# Altium schematic sheet buck4.schdoc
size A4; SheetNumber: 1; SheetTotal: 1
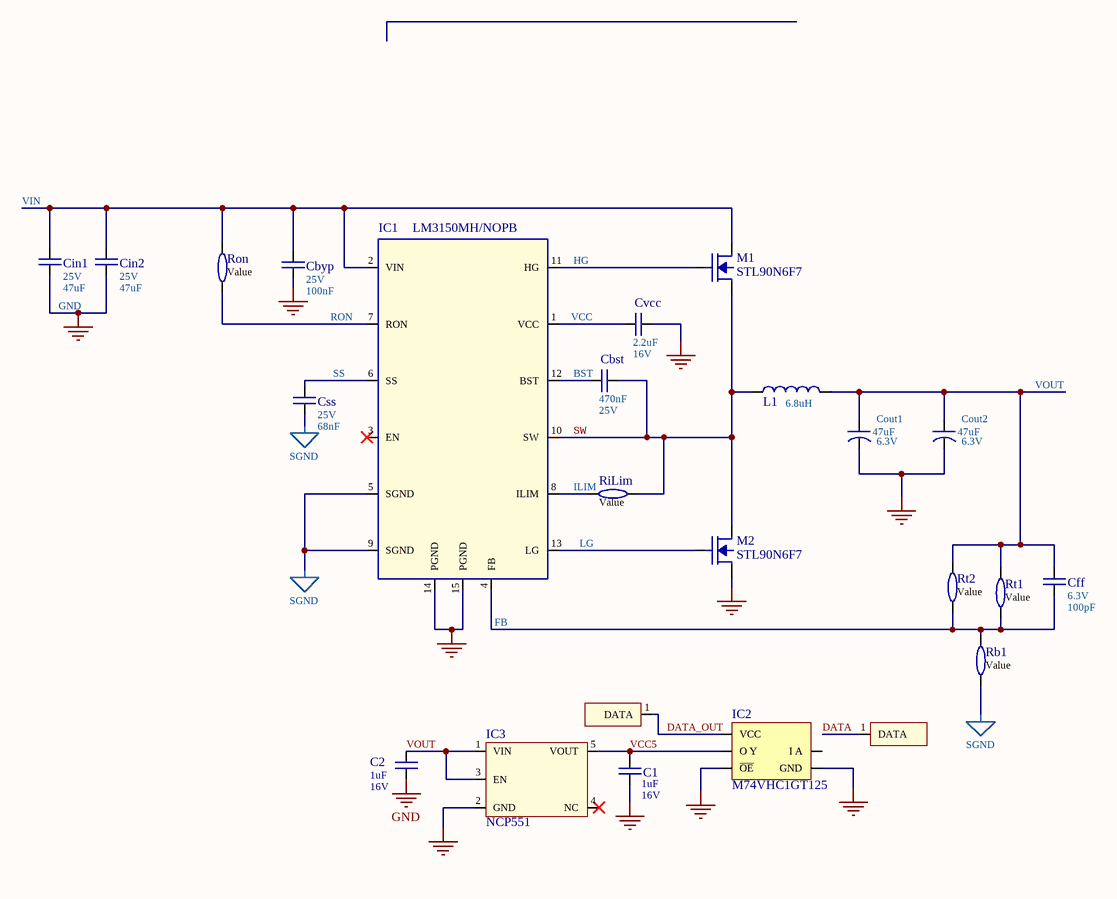
[diagram p0: buck4.schdoc]

## Parts
C1  value 1uF  Voltage: 16V  [CAPC1608X08L]  (hidden comment: MLCC)
C2  value 1uF  Voltage: 16V  [CAPC1608X08L]  (hidden comment: MLCC)
Cbst  value 470nF  Voltage: 25V  [CAPC1608X08L]  (hidden comment: MLCC)
Cbyp  value 100nF  Voltage: 25V  [CAPC2012X12L]  (hidden comment: MLCC)
Cff  value 100pF  Voltage: 6.3V  [CAPC1608X08L]  (hidden comment: MLCC)
Cin1  value 47uF  Voltage: 25V  [CAPC3225X25L]  (hidden comment: MLCC)
Cin2  value 47uF  Voltage: 25V  [CAPC3225X25L]  (hidden comment: MLCC)
Cout1  value 47uF  Voltage: 6.3V  [CAPMP7343X11L]  (hidden comment: CAPACITOR)
Cout2  value 47uF  Voltage: 6.3V  [CAPMP7343X11L]  (hidden comment: CAPACITOR)
Css  value 68nF  Voltage: 25V  [CAPC1608X08L]  (hidden comment: MLCC)
Cvcc  value 2.2uF  Voltage: 16V  [CAPC1608X08L]  (hidden comment: MLCC)
DP1  DATA_PAD  [DATA_PAD]  (value not drawn)  (no BOM)
DP2  DATA_PAD  [DATA_PAD]  (value not drawn)  (no BOM)
IC1  LM3150MH/NOPB  [MXA14A]
IC2  M74VHC1GT125  [SC70-5]
IC3  NCP551  [SOT95P260X90-5L]
L1  value 6.8uH  [WE-HCI_1335]  (hidden comment: 744313330)
M1  STL90N6F7  [TRANS_NexFET_Q5A]
M2  STL90N6F7  [TRANS_NexFET_Q5A]
Rb1  RES0603  [RESC1608X03L]  (value not drawn)
RiLim  RES0603  [RESC1608X03L]  (value not drawn)
Ron  RES0603  [RESC1608X03L]  (value not drawn)
Rt1  RES0603  [RESC1608X03L]  (value not drawn)
Rt2  RES0603  [RESC1608X03L]  (value not drawn)

## Nets
GND: C1.1 C2.1 Cbyp.1 Cin1.1 Cin2.1 Cout1.2(-) Cout2.2(-) Cvcc.2 IC1.14(PGND) IC1.15(PGND) IC2.1(~{OE}) IC2.3(GND) IC3.2(GND) M2.S(Source)
SGND: Css.1 IC1.5(SGND) IC1.9(SGND) Rb1.1
BST: Cbst.1 IC1.12(BST)
DATA: DP2.1(DATA)
DATA_OUT: DP1.1(DATA) IC2.5(VCC)
FB: Cff.1 IC1.4(FB) Rb1.2 Rt1.1 Rt2.1
HG: IC1.11(HG) M1.G(Gate)
ILIM: IC1.8(ILIM) RiLim.1
LG: IC1.13(LG) M2.G(Gate)
RON: IC1.7(RON) Ron.2
SS: Css.2 IC1.6(SS)
SW: Cbst.2 IC1.10(SW) L1.2 M1.S(Source) M2.D(Drain) RiLim.2
VCC: Cvcc.1 IC1.1(VCC)
VCC5: C1.2 IC2.4(O_Y) IC3.5(VOUT)
VIN: Cbyp.2 Cin1.2 Cin2.2 IC1.2(VIN) M1.D(Drain) Ron.1
VOUT: C2.2 Cff.2 Cout1.1(+) Cout2.1(+) IC3.1(VIN) IC3.3(EN) L1.1 Rt1.2 Rt2.2

Not connected (* = marked no-connect by the designer): IC1 3(EN)*; IC2 2(I_A); IC3 4(NC)*

## Library data of the parts
C1 C2 Cbst Cbyp Cff Css Cvcc = MLCC: Multilayer Ceramic Capacitor
  C1 C2: Vendor: *
Cin1 Cin2 = MLCC: Multilayer Ceramic Capacitor; MPN: C3216X5R1E476M160AC; Vendor: TDK
Cout1 Cout2 = CAPACITOR: Electrolytic Capacitor; MPN: EEFCS1A470R; Vendor: Pansonic; TYPE: Polymer
IC1 = LM3150MH/NOPB: Buck controller; Vendor: Texas Instruments; Manufacturer_Part_Number: LM3150MH/NOPB; RefDes: RefDes; TYPE: TYPE; MPN: LM3150MH/NOPB
IC2 = M74VHC1GT125: Level shifter non inverting
L1 = 744313330: Inductor; Vendor: Wurth Elektronik; Manufacturer_Part_Number: 744313330; RefDes: RefDes; TYPE: TYPE; MPN: 744313330
M1 = CSD17579Q5A: N Channel MOSFET; VdsMax: 30.0V; IdsMax: 14.0A; Rdsonat10V: 0.0084Ohm; QgTyp: 5.4nC; Vendor: Texas Instruments; Datasheet_URL: http://www.ti.com/lit/ds/symlink/CSD17579Q5A.pdf; Quantity: 1; Manufacturer_Part_Number: CSD17579Q5A; RefDes: RefDes; TYPE: TYPE; MPN: CSD17579Q5A
M2 = CSD18537NQ5A: N Channel MOSFET; VdsMax: 60.0; IdsMax: 50.0; Rdson45: 0.014559; QgTyp: 14.0; Vendor: Texas Instruments; Datasheet_URL: http://www.ti.com/lit/ds/symlink/csd18537nq5a.pdf; Quantity: 1; Manufacturer_Part_Number: CSD18537NQ5A; RefDes: RefDes; TYPE: TYPE; MPN: CSD18537NQ5A
Rb1 RiLim Ron Rt1 Rt2 = RES0603: Chip Resistor; Value: Value